# EAGLE design coin_acceptor_test_route (EAGLE 8.3.1)
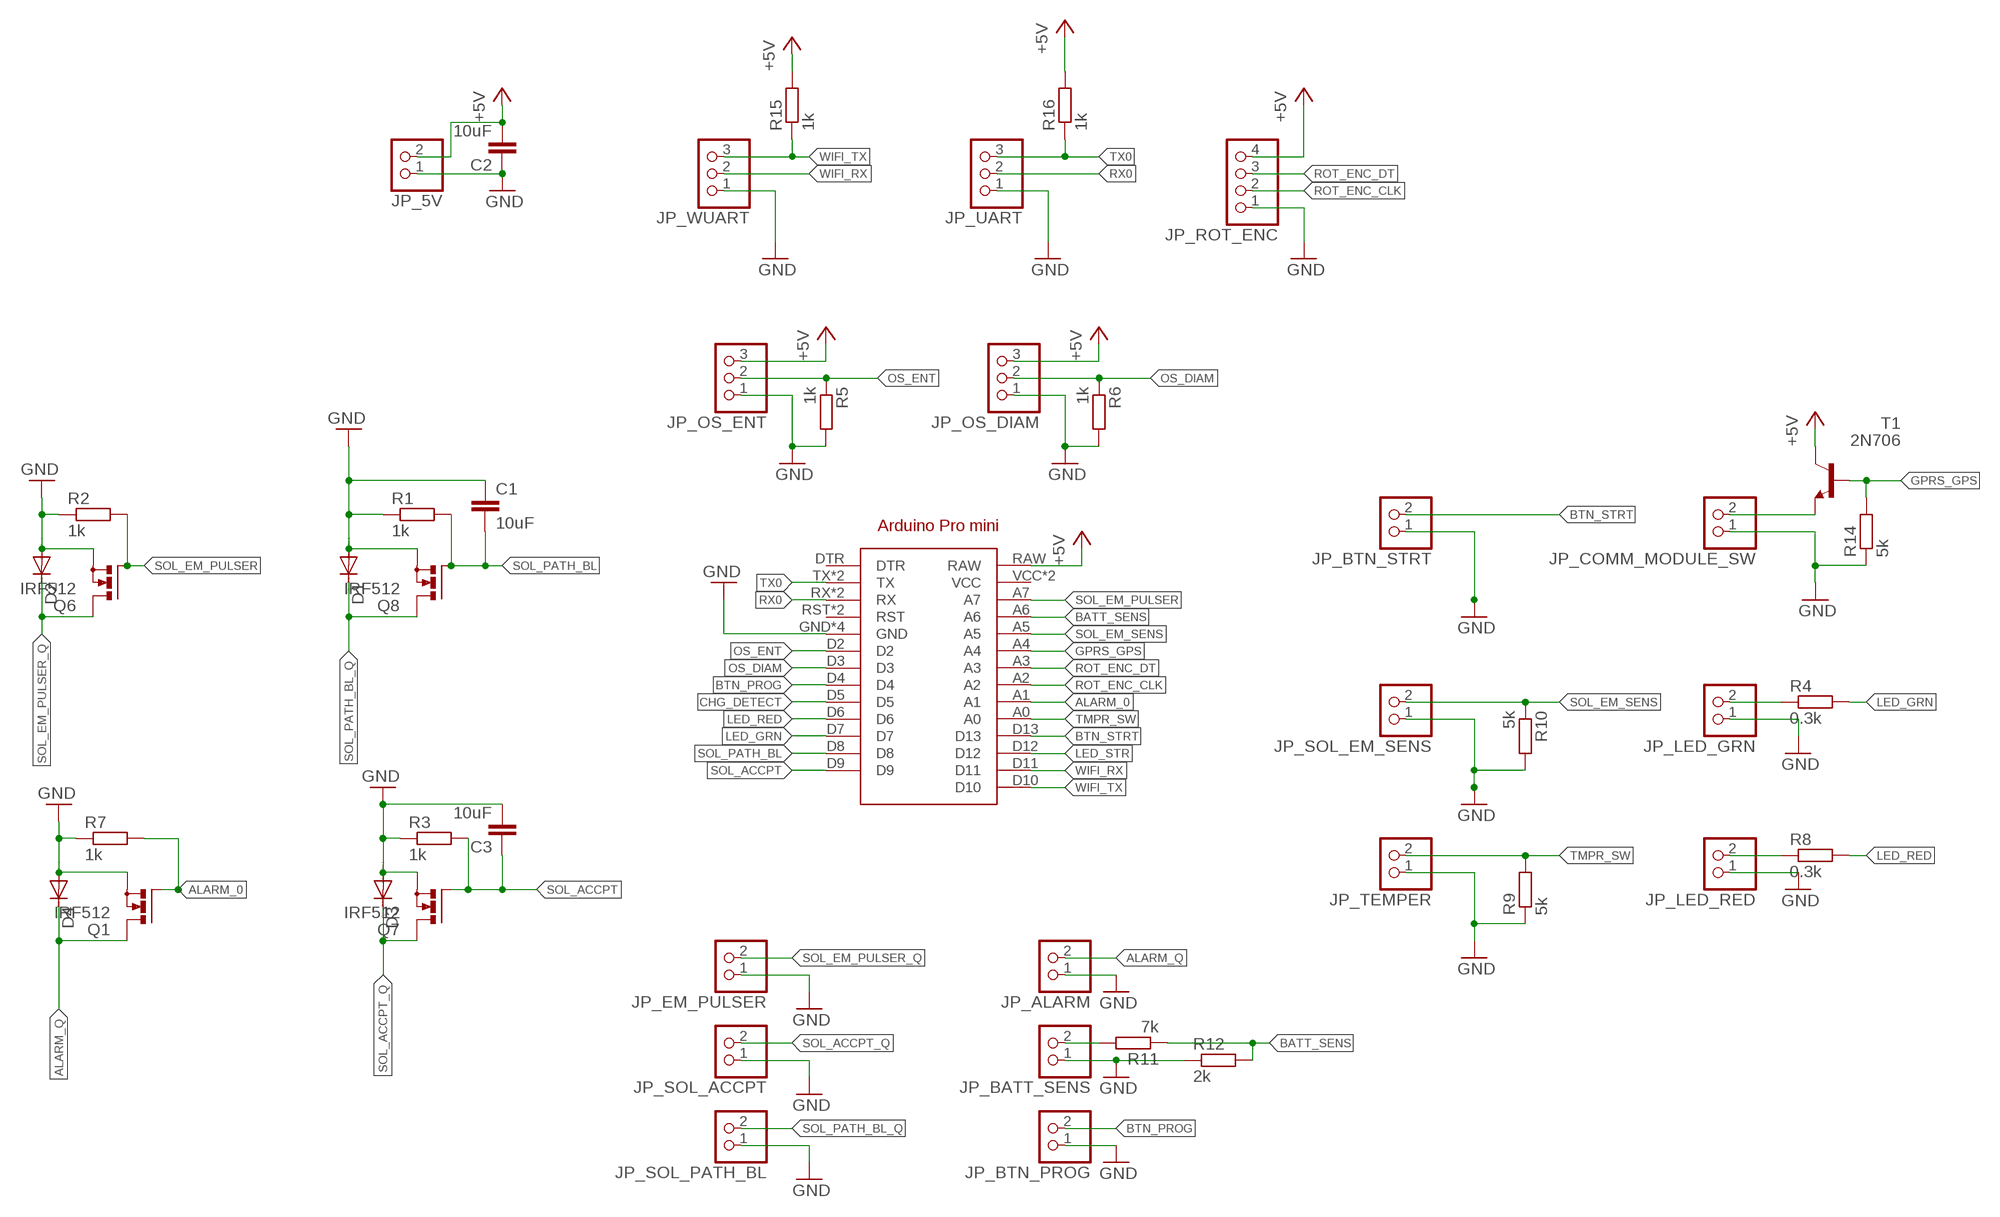
[diagram p0: schematic, sheet 1]

## Parts
ARDUINO1  ARDUINO_PRO_MINI  [ARDUINO_PRO_MINI]
C1  10uF  C-EU025-024X044  [C025-024X044]
C2  10uF  C-EU025-024X044  [C025-024X044]
C3  10uF  C-EU025-024X044  [C025-024X044]
D1  DIODE-DO35-10  [DO35-10]
D2  DIODE-DO35-10  [DO35-10]
D3  DIODE-DO35-10  [DO35-10]
D4  DIODE-DO35-10  [DO35-10]
JP_5V  PINHD-1X2  [1X02]
JP_ALARM  PINHD-1X2  [1X02]
JP_BATT_SENS  PINHD-1X2  [1X02]
JP_BTN_PROG  PINHD-1X2  [1X02]
JP_BTN_STRT  PINHD-1X2  [1X02]
JP_COMM_MODULE_SW  PINHD-1X2  [1X02]
JP_EM_PULSER  PINHD-1X2  [1X02]
JP_LED_GRN  PINHD-1X2  [1X02]
JP_LED_RED  PINHD-1X2  [1X02]
JP_OS_DIAM  PINHD-1X3  [1X03]
JP_OS_ENT  PINHD-1X3  [1X03]
JP_ROT_ENC  PINHD-1X4  [1X04]
JP_SOL_ACCPT  PINHD-1X2  [1X02]
JP_SOL_EM_SENS  PINHD-1X2  [1X02]
JP_SOL_PATH_BL  PINHD-1X2  [1X02]
JP_TEMPER  PINHD-1X2  [1X02]
JP_UART  PINHD-1X3  [1X03]
JP_WUART  PINHD-1X3  [1X03]
Q1  IRF512  [TO220BV]
Q6  IRF512  [TO220BV]
Q7  IRF512  [TO220BV]
Q8  IRF512  [TO220BV]
R1  1k  R-EU_0309/10  [0309/10]
R2  1k  R-EU_0309/10  [0309/10]
R3  1k  R-EU_0309/10  [0309/10]
R4  0.3k  R-EU_0309/10  [0309/10]
R5  1k  R-EU_0309/10  [0309/10]
R6  1k  R-EU_0309/10  [0309/10]
R7  1k  R-EU_0309/10  [0309/10]
R8  0.3k  R-EU_0309/10  [0309/10]
R9  5k  R-EU_0309/10  [0309/10]
R10  5k  R-EU_0309/10  [0309/10]
R11  7k  R-EU_0309/10  [0309/10]
R12  2k  R-EU_0309/10  [0309/10]
R14  5k  R-EU_0309/10  [0309/10]
R15  1k  R-EU_0309/10  [0309/10]
R16  1k  R-EU_0309/10  [0309/10]
T1  2N706  [TO18]

## Nets
+5V: ARDUINO1.RAW C2.2 JP_5V.2 JP_OS_DIAM.3 JP_OS_ENT.3 JP_ROT_ENC.4 R15.2 R16.2 T1.3(C)
ALARM_0: ARDUINO1.A1 Q1.G R7.2
ALARM_Q: D4.C JP_ALARM.2 Q1.D
BATT_SENS: ARDUINO1.A6 R11.1 R12.2
BTN_PROG: ARDUINO1.D4 JP_BTN_PROG.2
BTN_STRT: ARDUINO1.D13 JP_BTN_STRT.2
CHG_DETECT: ARDUINO1.D5
GND [Ground]: ARDUINO1.GND ARDUINO1.GND@1(GND) ARDUINO1.GND@2(GND) ARDUINO1.GND@3(GND) C1.1 C2.1 C3.2 D1.A D2.A D3.A D4.A JP_5V.1 JP_ALARM.1 JP_BATT_SENS.1 JP_BTN_PROG.1 JP_BTN_STRT.1 JP_COMM_MODULE_SW.1 JP_EM_PULSER.1 JP_LED_GRN.1 JP_LED_RED.1 JP_OS_DIAM.1 JP_OS_ENT.1 JP_ROT_ENC.1 JP_SOL_ACCPT.1 JP_SOL_EM_SENS.1 JP_SOL_PATH_BL.1 JP_TEMPER.1 JP_UART.1 JP_WUART.1 Q1.S Q6.S Q7.S Q8.S R1.1 R2.1 R3.1 R5.2 R6.2 R7.1 R9.1 R10.2 R12.1 R14.1
GPRS_GPS: ARDUINO1.A4 R14.2 T1.2(B)
LED_GRN: ARDUINO1.D7 R4.2
LED_RED: ARDUINO1.D6 R8.2
LED_STR: ARDUINO1.D12
N$1: JP_BATT_SENS.2 R11.2
OS_DIAM: ARDUINO1.D3 JP_OS_DIAM.2 R6.1
OS_ENT: ARDUINO1.D2 JP_OS_ENT.2 R5.1
ROT_ENC_CLK: ARDUINO1.A2 JP_ROT_ENC.2
ROT_ENC_DT: ARDUINO1.A3 JP_ROT_ENC.3
RX0: ARDUINO1.RX ARDUINO1.RX@1(RX) JP_UART.2
SOL_ACCPT: ARDUINO1.D9 C3.1 Q7.G R3.2
SOL_ACCPT_OUT2: JP_LED_GRN.2 R4.1
SOL_ACCPT_Q: D3.C JP_SOL_ACCPT.2 Q7.D
SOL_EM_PULSER: ARDUINO1.A7 Q6.G R2.2
SOL_EM_PULSER_OUT2: JP_COMM_MODULE_SW.2 T1.1(E)
SOL_EM_PULSER_Q: D2.C JP_EM_PULSER.2 Q6.D
SOL_EM_SENS: ARDUINO1.A5 JP_SOL_EM_SENS.2 R10.1
SOL_PATH_BL: ARDUINO1.D8 C1.2 Q8.G R1.2
SOL_PATH_BL_OUT2: JP_LED_RED.2 R8.1
SOL_PATH_BL_Q: D1.C JP_SOL_PATH_BL.2 Q8.D
TMPR_SW: ARDUINO1.A0 JP_TEMPER.2 R9.2
TX0: ARDUINO1.TX ARDUINO1.TX@1(TX) JP_UART.3 R16.1
WIFI_RX: ARDUINO1.D11 JP_WUART.2
WIFI_TX: ARDUINO1.D10 JP_WUART.3 R15.1
Unconnected: ARDUINO1.DTR ARDUINO1.RST ARDUINO1.RST@1(RST)

## Power pins joined to a net without a drawn wire
VCC: ARDUINO1.VCC ARDUINO1.VCC@1(VCC)

## Library data of the parts
ARDUINO1 = arduinopromini:ARDUINO_PRO_MINI: For creating Arduino Pro Mini shields
C1-C3 = rcl:C-EU: CAPACITOR, European symbol
D1-D4 = diode:DIODE-: DIODE
JP_5V JP_ALARM JP_BATT_SENS JP_BTN_PROG JP_BTN_STRT JP_COMM_MODULE_SW JP_EM_PULSER JP_LED_GRN JP_LED_RED JP_SOL_ACCPT JP_SOL_EM_SENS JP_SOL_PATH_BL JP_TEMPER = pinhead:PINHD-1X2: PIN HEADER
JP_OS_DIAM JP_OS_ENT JP_UART JP_WUART = pinhead:PINHD-1X3: PIN HEADER
JP_ROT_ENC = pinhead:PINHD-1X4: PIN HEADER
Q1 Q6-Q8 = transistor-power:IRF512: N-CHANNEL MOS FET
R1-R12 R14-R16 = resistor:R-EU_: RESISTOR, European symbol
T1 = transistor:2N706: NPN TRANSISTOR

## Net classes
0 default: width 0.406 mm
1 Ground: width 0.61 mm

## Board
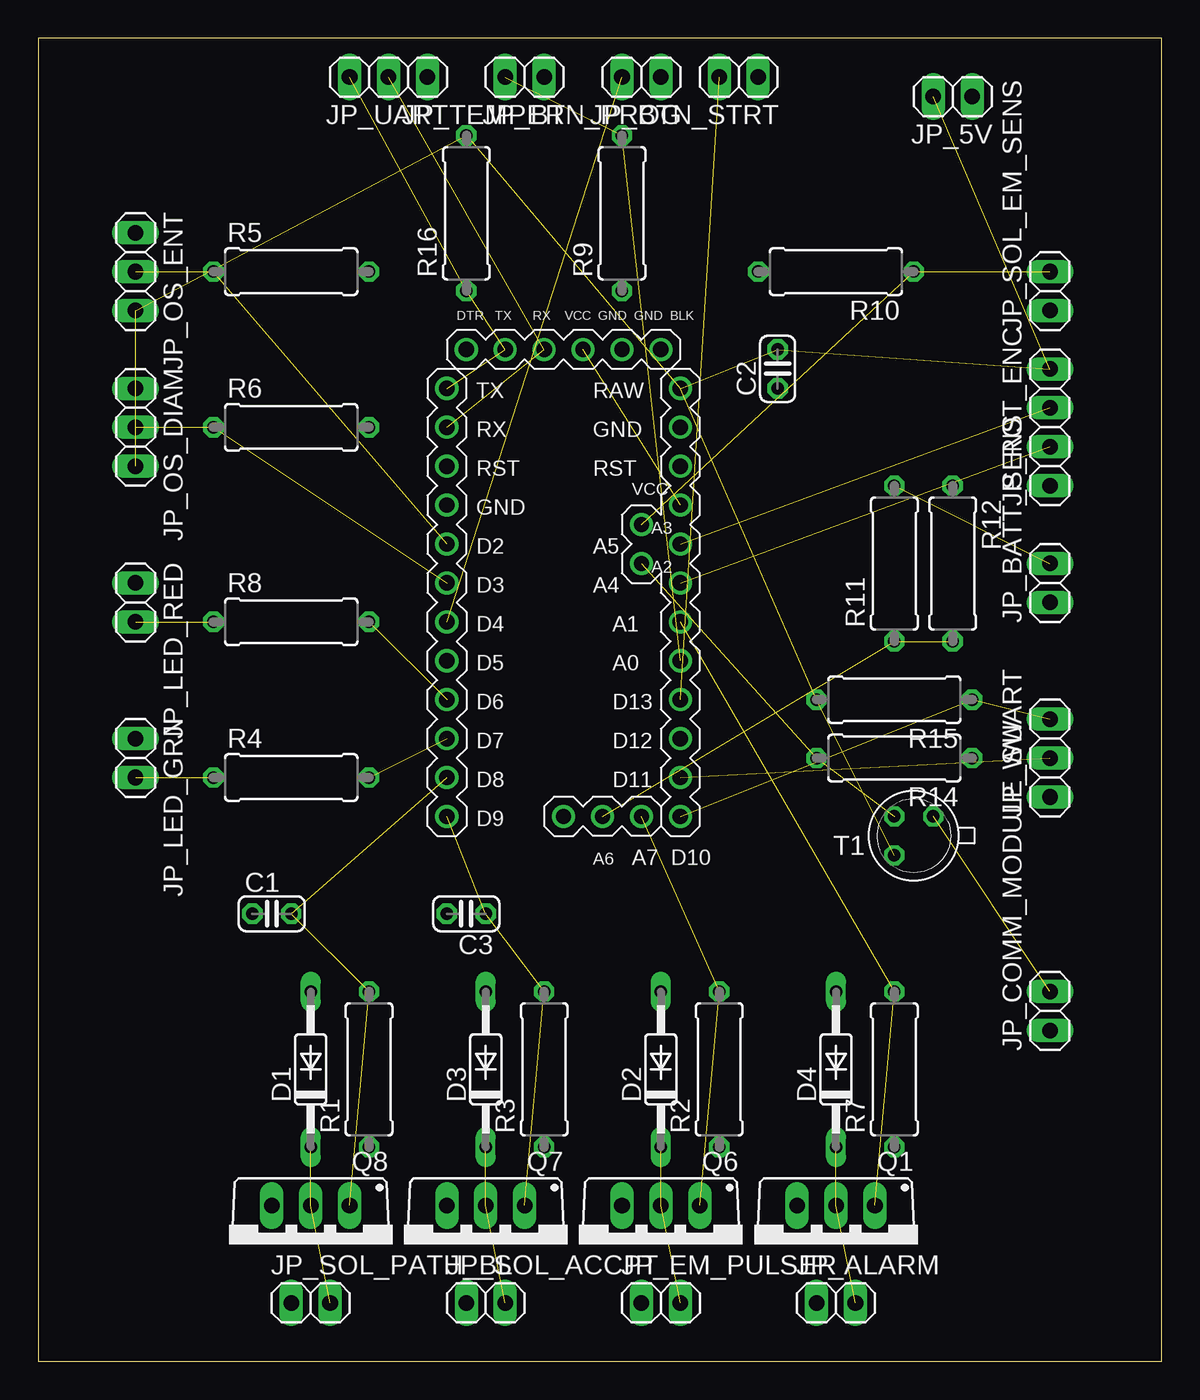
[diagram p1: board, top side]
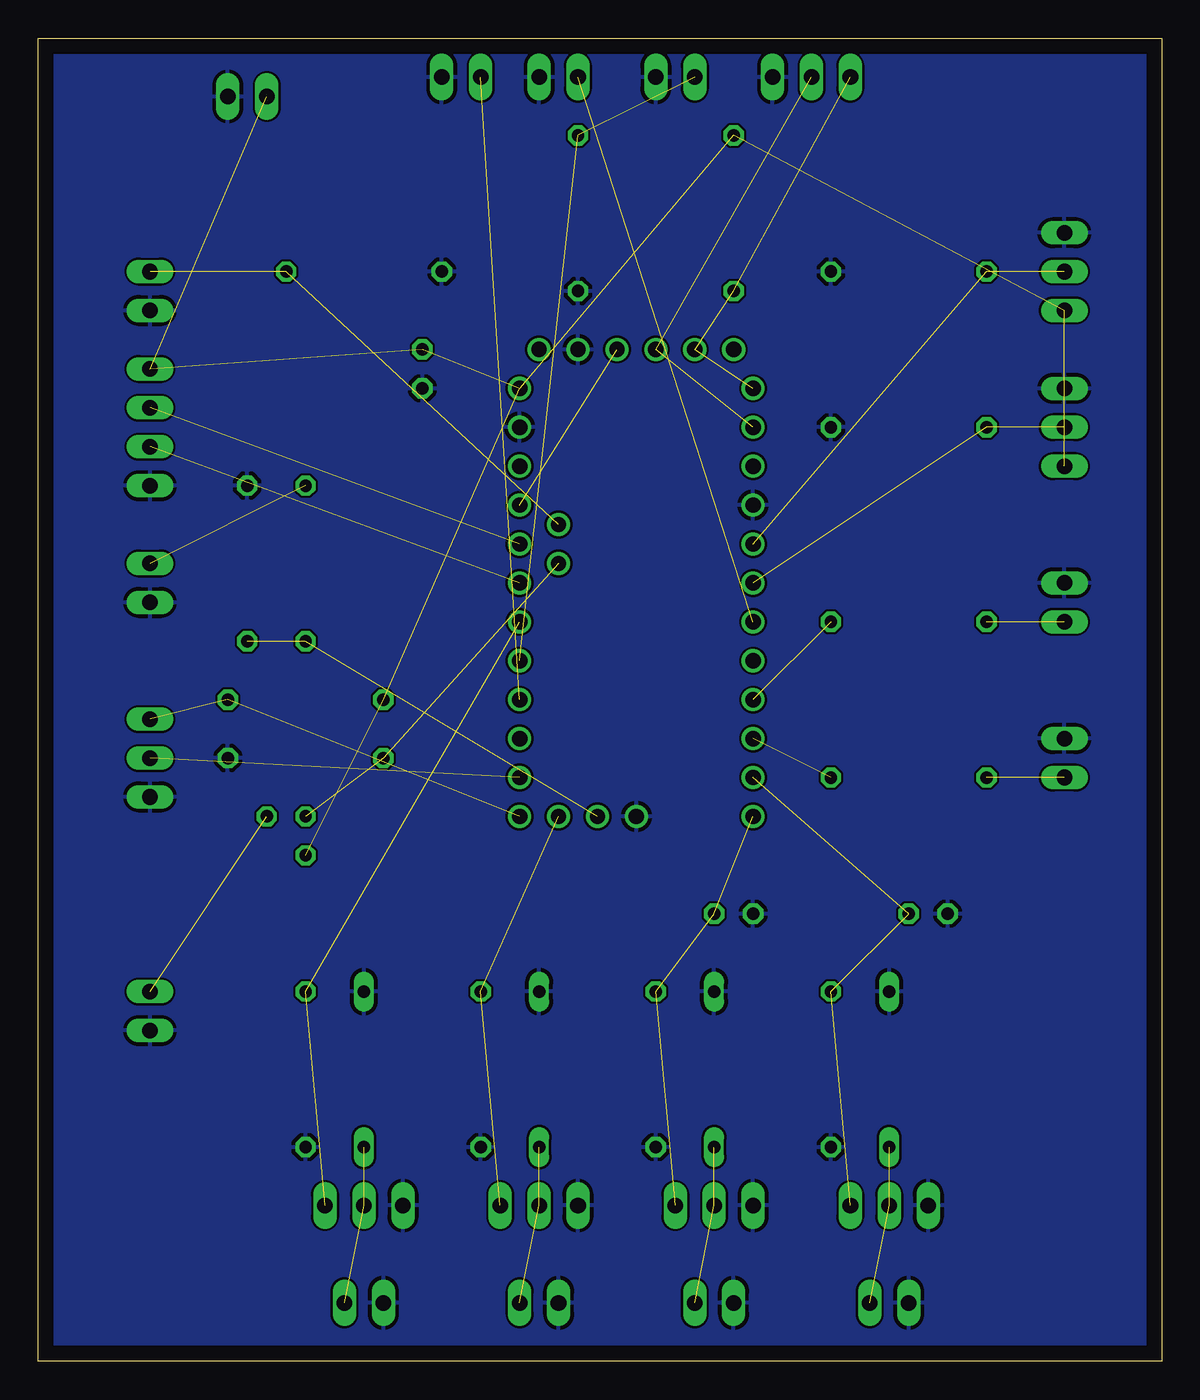
[diagram p2: board, bottom side, seen from below]

Size 73.33 x 86.35 mm. Coordinates in mm from the lower left corner, seen from the top.
Outline: 0,0 73.33,0 73.33,86.35 0,86.35 0,0
Copper layers (1*16): Top 0.035mm / dielectric 1.5mm / Bottom 0.035mm
Design rules "default": minimum track width 6mil, minimum drill 0.35mm, track to track 6mil, track to pad 6mil, pad to pad 6mil, via to via 6mil, smd to smd 6mil, copper to edge 40mil, drill to drill 6mil, minimum pad ring 10mil, minimum via ring 8mil, stop-mask expansion 4mil, vias tented up to drill 0mil, thermal gap 10mil

### Footprints (pad centres in the part's own frame; a part is rotated, then mirrored left to right if it is on the bottom)
ARDUINO_PRO_MINI = drill 1: A0 11.43,-8.89; A1 11.43,-6.35; A2 11.43,-3.81; A3 11.43,-1.27; A4 8.89,-2.54; A5 8.89,0; A6 6.35,-19.05; A7 8.89,-19.05; BLK 10.16,11.43; D2 -3.81,-1.27; D3 -3.81,-3.81; D4 -3.81,-6.35; D5 -3.81,-8.89; D6 -3.81,-11.43; D7 -3.81,-13.97; D8 -3.81,-16.51; D9 -3.81,-19.05; D10 11.43,-19.05; D11 11.43,-16.51; D12 11.43,-13.97; D13 11.43,-11.43; DTR -2.54,11.43; GND -3.81,1.27; GND@1 11.43,6.35; GND@2 7.62,11.43; GND@3 3.81,-19.05; RAW 11.43,8.89; RST 11.43,3.81; RST@1 -3.81,3.81; RX -3.81,6.35; RX@1 2.54,11.43; TX -3.81,8.89; TX@1 0,11.43; VCC 11.43,1.27; VCC@1 5.08,11.43
C025-024X044 = drill 0.813 octagon: 1 -1.27,0; 2 1.27,0
DO35-10 = drill 0.813 long: A 5.08,0; C -5.08,0
1X02 = drill 1.016 long: 1 -1.27,0; 2 1.27,0
1X03 = drill 1.016 long: 1 -2.54,0; 2 0,0; 3 2.54,0
1X04 = drill 1.016 long: 1 -3.81,0; 2 -1.27,0; 3 1.27,0; 4 3.81,0
TO220BV = drill 1.016 long: D 0,-2.54; G -2.54,-2.54; S 2.54,-2.54
0309/10 = drill 0.813 octagon: 1 -5.08,0; 2 5.08,0
TO18 = drill 0.813 octagon: 1 -1.27,-1.27; 2 1.27,-1.27; 3 1.27,1.27

### Placement (x,y rotation side)
ARDUINO1  30.48,54.61 0 top
C1  15.24,29.21 0 top
C2  48.26,64.77 90 top
C3  27.94,29.21 180 top
D1  17.78,19.05 90 top
D2  40.64,19.05 90 top
D3  29.21,19.05 90 top
D4  52.07,19.05 90 top
JP_5V  59.69,82.55 180 top
JP_ALARM  52.07,3.81 0 top
JP_BATT_SENS  66.04,50.8 90 top
JP_BTN_PROG  39.37,83.82 180 top
JP_BTN_STRT  45.72,83.82 180 top
JP_COMM_MODULE_SW  66.04,22.86 90 top
JP_EM_PULSER  40.64,3.81 0 top
JP_LED_GRN  6.35,39.37 270 top
JP_LED_RED  6.35,49.53 270 top
JP_OS_DIAM  6.35,60.96 270 top
JP_OS_ENT  6.35,71.12 270 top
JP_ROT_ENC  66.04,60.96 90 top
JP_SOL_ACCPT  29.21,3.81 0 top
JP_SOL_EM_SENS  66.04,69.85 90 top
JP_SOL_PATH_BL  17.78,3.81 0 top
JP_TEMPER  31.75,83.82 180 top
JP_UART  22.86,83.82 180 top
JP_WUART  66.04,39.37 90 top
Q1  52.07,7.62 180 top
Q6  40.64,7.62 180 top
Q7  29.21,7.62 180 top
Q8  17.78,7.62 180 top
R1  21.59,19.05 90 top
R2  44.45,19.05 90 top
R3  33.02,19.05 90 top
R4  16.51,38.1 0 top
R5  16.51,71.12 0 top
R6  16.51,60.96 0 top
R7  55.88,19.05 90 top
R8  16.51,48.26 0 top
R9  38.1,74.93 90 top
R10  52.07,71.12 180 top
R11  55.88,52.07 90 top
R12  59.69,52.07 270 top
R14  55.88,39.37 180 top
R15  55.88,43.18 180 top
R16  27.94,74.93 90 top
T1  57.15,34.29 180 top

### Tracks (layer width: path | path; a pad name or v marks a point on that pad's centre or on a via)
+5V  (8 unrouted)
ALARM_0  (2 unrouted)
ALARM_Q  (2 unrouted)
BATT_SENS  (2 unrouted)
BTN_PROG  (1 unrouted)
BTN_STRT  (1 unrouted)
GND
  pour Bottom: -1.27,90.17 76.2,90.17 77.47,88.9 77.47,-2.54 -6.35,-2.54 -6.35,85.09
GPRS_GPS  (2 unrouted)
LED_GRN  (1 unrouted)
LED_RED  (1 unrouted)
N$1  (1 unrouted)
OS_DIAM  (2 unrouted)
OS_ENT  (2 unrouted)
ROT_ENC_CLK  (1 unrouted)
ROT_ENC_DT  (1 unrouted)
RX0  (2 unrouted)
SOL_ACCPT  (3 unrouted)
SOL_ACCPT_OUT2  (1 unrouted)
SOL_ACCPT_Q  (2 unrouted)
SOL_EM_PULSER  (2 unrouted)
SOL_EM_PULSER_OUT2  (1 unrouted)
SOL_EM_PULSER_Q  (2 unrouted)
SOL_EM_SENS  (2 unrouted)
SOL_PATH_BL  (3 unrouted)
SOL_PATH_BL_OUT2  (1 unrouted)
SOL_PATH_BL_Q  (2 unrouted)
TMPR_SW  (2 unrouted)
TX0  (3 unrouted)
VCC  (1 unrouted)
WIFI_RX  (1 unrouted)
WIFI_TX  (2 unrouted)
(copper drawn outside any net)
  shapes: Top area x2